# Altium schematic sheet Power.SchDoc
size A3
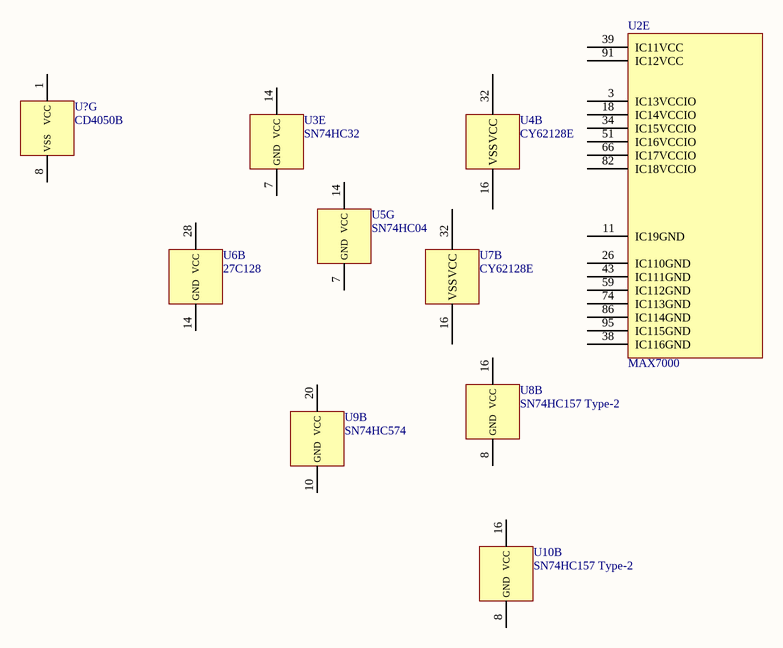
[diagram p0: Power.SchDoc]

## Parts
U2  MAX7000  [TQFP100]  (part E of 6)
U3  SN74HC32  [SOIC14]  (part E of 5)
U4  CY62128E  [CY62128E-SOIC]  (part B of 2)
U5  SN74HC04  [SOIC14]  (part G of 7)
U6  27C128  [PDIP28]  (part B of 2)
U7  CY62128E  [CY62128E-SOIC]  (part B of 2)
U8  SN74HC157 Type-2  [TSSOP16]  (part B of 2)
U9  SN74HC574  [SOIC20]  (part B of 2)
U10  SN74HC157 Type-2  [TSSOP16]  (part B of 2)
U?  CD4050B  [TSSOP16]  (part G of 7)

## Nets

Not connected (* = marked no-connect by the designer): U2 3(IC13VCCIO) 11(IC19GND) 18(IC14VCCIO) 26(IC110GND) 34(IC15VCCIO) 38(IC116GND) 39(IC11VCC) 43(IC111GND) 51(IC16VCCIO) 59(IC112GND) 66(IC17VCCIO) 74(IC113GND) 82(IC18VCCIO) 86(IC114GND) 91(IC12VCC) 95(IC115GND); U3 7(GND) 14(VCC); U4 16(VSS) 32(VCC); U5 7(GND) 14(VCC); U6 14(GND) 28(VCC); U7 16(VSS) 32(VCC); U8 8(GND) 16(VCC); U9 10(GND) 20(VCC); U10 8(GND) 16(VCC); U? 1(VCC) 8(VSS)

## Library data of the parts
U3 = SN74HC32: Quadruple 2-Input Positive-OR Gates
U4 U7 = CY62128E: 128KB Static RAM
U5 = SN74HC04: Hex Inverters
U6 = 27C128: 128K (16K x 8) CMOS EPROM
U8 U10 = SN74HC157 Type-2: Quadruple 2-Line To 1-Line Data Selectors/Mutiplexers
U9 = SN74HC574 Type-2: Octal Edge-Triggered D-Type Flip-Flops With 3-State Outputs
U? = CD4050B: CMOS Hex Buffers/Converters Non-Inverting Type